# EAGLE design htsenti_mvp (EAGLE 9.6.2)
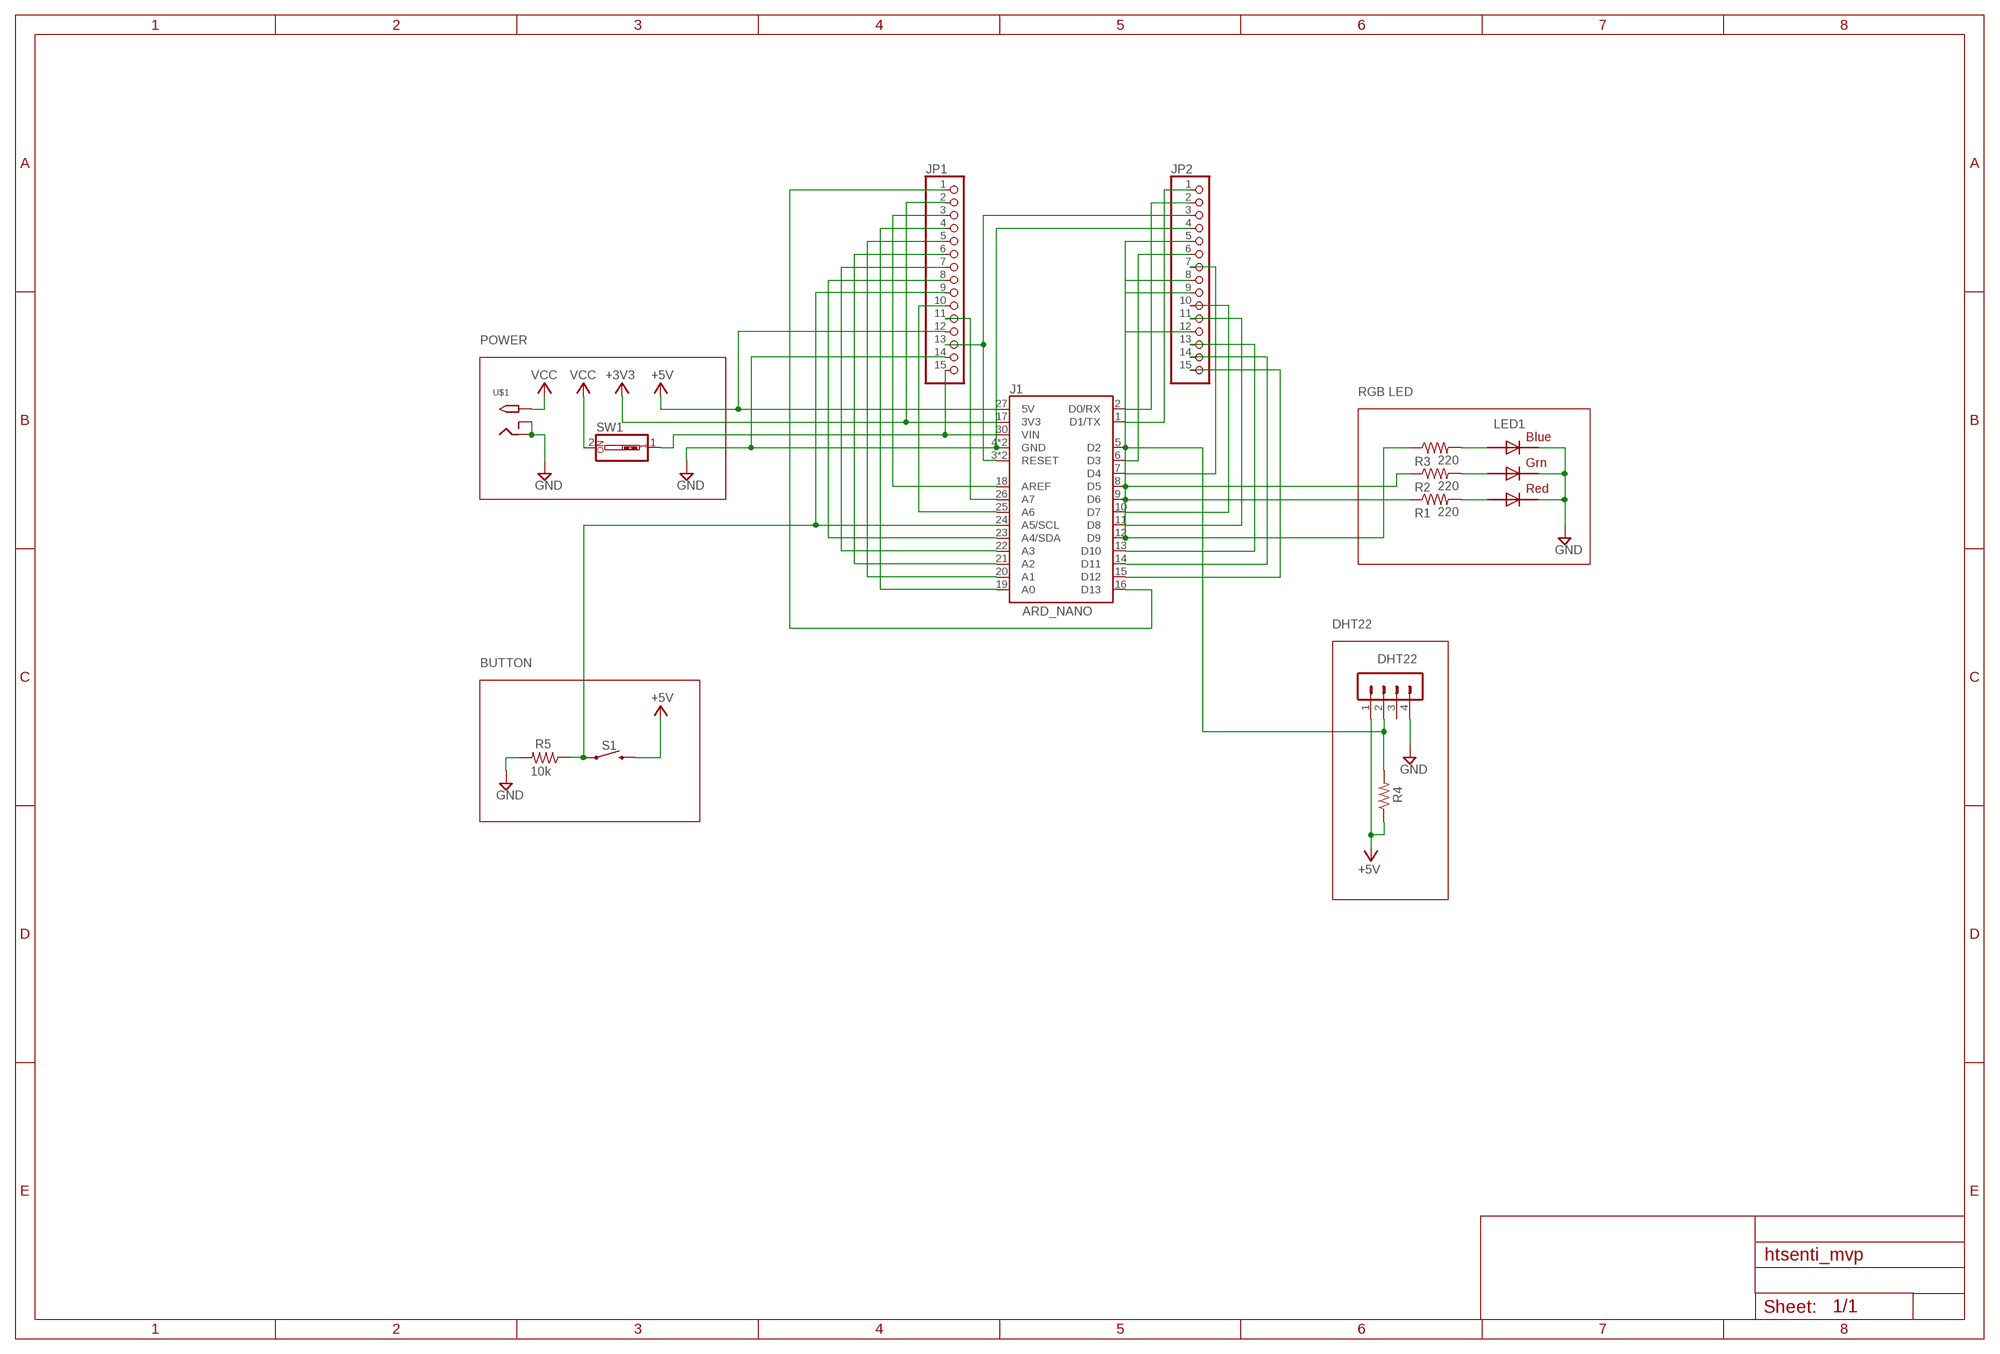
[diagram p0: schematic, sheet 1]

## Parts
DHT22  MA04-1  [MA04-1]
J1  NANO_FOOTPRINT  [NANO]
JP1  PINHD-1X15  [1X15]
JP2  PINHD-1X15  [1X15]
LED1  RGBLED5050  [RGBLED5050]
R1  220  220OHM-0603-1/10W-1%  [0603]
R2  220  220OHM-0603-1/10W-1%  [0603]
R3  220  220OHM-0603-1/10W-1%  [0603]
R4  R-US_M0805  [M0805]
R5  10k  R-US_M0805  [M0805]
S1  MOMENTARY-SWITCH-SPST-SMD-6.2MM-TALL  [TACTILE_SWITCH_SMD_6.2MM_TALL]
SW1  SW_DIP-1  [EDG-01]
U$1  2.1MMJACKSMT  [DCJACK_2MM_SMT]

## Nets
+3V3: J1.17(3V3) JP1.2
+5V: DHT22.1 J1.27(5V) JP1.12 R4.1 S1.B2
GND: DHT22.4 J1.4(GND) J1.29(GND) JP1.14 JP2.4 LED1.4(BLUE_C) LED1.5(RED_C) LED1.6(GREEN_C) R5.2 U$1.GND(RING) U$1.GNDBREAK(RING_SW)
N$1: LED1.2(RED_A) R1.2
N$2: LED1.1(GREEN_A) R2.2
N$3: LED1.3(BLUE_A) R3.2
N$4: J1.9(D6) JP2.9 R1.1
N$5: J1.8(D5) JP2.8 R2.1
N$6: J1.12(D9) JP2.12 R3.1
N$7: DHT22.2 J1.5(D2) JP2.5 R4.2
N$8: J1.24(A5/SCL) JP1.9 R5.1 S1.A2
N$9: J1.1(D1/TX) JP2.1
N$10: J1.30(VIN) JP1.15 SW1.1
N$11: J1.2(D0/RX) JP2.2
N$12: J1.3(RESET) J1.28(RESET) JP1.13 JP2.3
N$13: J1.6(D3) JP2.6
N$14: J1.7(D4) JP2.7
N$15: J1.10(D7) JP2.10
N$16: J1.11(D8) JP2.11
N$17: J1.13(D10) JP2.13
N$18: J1.14(D11) JP2.14
N$19: J1.15(D12) JP2.15
N$20: J1.16(D13) JP1.1
N$21: J1.18(AREF) JP1.3
N$22: J1.19(A0) JP1.4
N$23: J1.20(A1) JP1.5
N$24: J1.21(A2) JP1.6
N$25: J1.22(A3) JP1.7
N$26: J1.23(A4/SDA) JP1.8
N$28: J1.25(A6) JP1.10
N$29: J1.26(A7) JP1.11
VCC: SW1.2 U$1.PWR2(TIP)
Unconnected: DHT22.3

## Notes on the sheet
- POWER
- RGB LED
- ARD_NANO
- DHT22
- BUTTON

## Library data of the parts
DHT22 = con-lstb:MA04-1: PIN HEADER; OC_FARNELL: unknown; OC_NEWARK: unknown
J1 = SparkFun-Boards:NANO_FOOTPRINT: Generic Nano Footprint
JP1 JP2 = adafruit:PINHD-1X15: PIN HEADER
LED1 = adafruit:RGBLED: For 5050 RGB LEDs, the order of the LEDs may vary from one manufacturer to another!
R1-R3 = SparkFun-Resistors:220OHM: 220Ω resistor A resistor is a passive two-terminal electrical component that implements electrical resistance as a circuit element. Resistors act to reduce current flow, and, at the same time, act to lower voltage levels within circuits. - Wikipedia; PROD_ID: RES-07861
R4 R5 = adafruit:R-US_: RESISTOR, American symbol
S1 = SparkFun-Switches:MOMENTARY-SWITCH-SPST: Momentary Switch (Pushbutton) - SPST Normally-open (NO) SPST momentary switches (buttons, pushbuttons). Variants PTH-12MM - 12mm square, through-hole Momentary Pushbutton Switch - 12mm Square <https://www.sparkfun.com/products/9190> (COM-09190) PTH-6.0MM, PTH-6.0MM-KIT - 6.0mm square, through-hole Mini Pushbutton Switch <https://www.sparkfun.com/products/97> (COM-00097) KIT package intended for soldering kit's - only one side of pads' copper is exposed. PTH-RIGHT-ANGLE-KIT - Right-angle, through-hole Right Angle Tactile Button <https://www.sparkfun.com/products/10791> - Used on SparkFun BigTime Watch Kit <https://www.sparkfun.com/products/11734> SMD-12MM - 12mm square, surface-mount Tactile Button - SMD (12mm) <https://www.sparkfun.com/products/12993> (COM-12993) Used on SparkFun PicoBoard <https://www.sparkfun.com/products/11888> SMD-4.5MM - 4.5mm Square Trackball Switch Used on SparkFun Blackberry Trackballer Breakout <https://www.sparkfun.com/products/13169> SMD-4.6MMX2.8MM - 4.60mm x 2.80mm, surface mount Used on SparkFun SAMD21 Mini Breakout <https://www.sparkfun.com/products/13664> SMD-5.2MM, SMD-5.2-REDUNDANT - 5.2mm square, surface-mount Mini Pushbutton Switch - SMD <https://www.sparkfun.com/products/8720> (COM-08720) Used on Arduino Pro Mini <https://www.sparkfun.com/products/11114> REDUNDANT package connects both switch circuits together SMD-6.0X3.5MM - 6.0 x 3.5mm, surface mount Momentary Reset Switch SMD <https://www.sparkfun.com/products/8229> (COM-08229) SMD-6.2MM-TALL - 6.2mm square, surface mount Tactile Button - SMD (6mm) <https://www.sparkfun.com/products/12992> Used on SparkFun Digital Sandbox <https://www.sparkfun.com/products/12651> SMD-RIGHT-ANGLE - Right-angle, surface mount Used on SparkFun Block for Intel® Edison - Arduino <https://www.sparkfun.com/products/13036>; PROD_ID: SWCH-11966; SF_SKU: COM-12992
SW1 = special:SW_DIP-1: DIP SWITCH
U$1 = adafruit:2.1MMJACK: 2.1mm x 5.5mm THM DC jack with internal switch. Digikey part #PJ-102A, 4UCON part #05537 2.1mm x 5.5mm SMT DC jack with internal switch. Digikey part #PJ-002A-SMT, 4UCON part #03267 By microbuilder.eu & adafruit.com

## Board
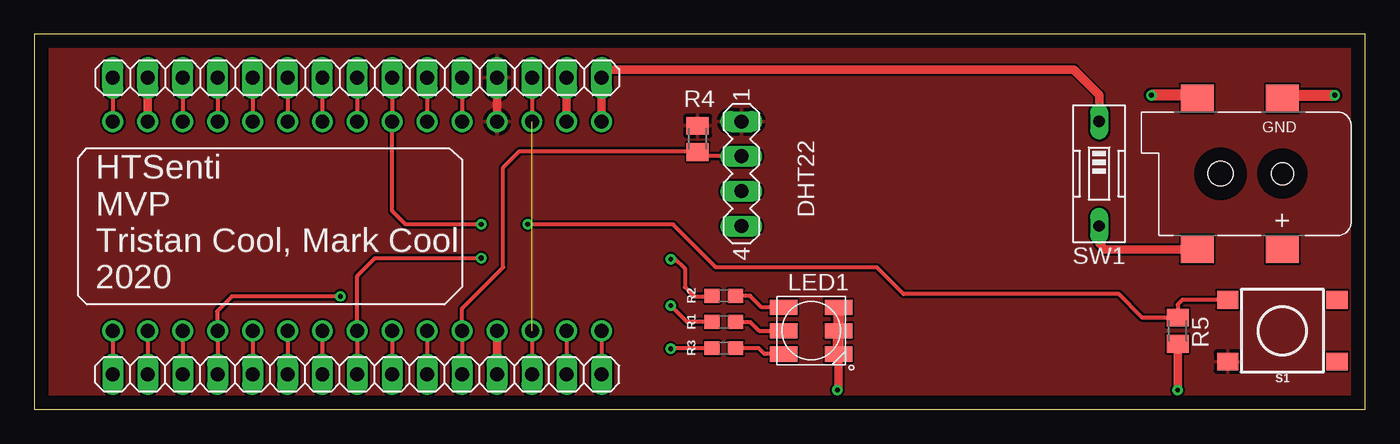
[diagram p1: board, top side]
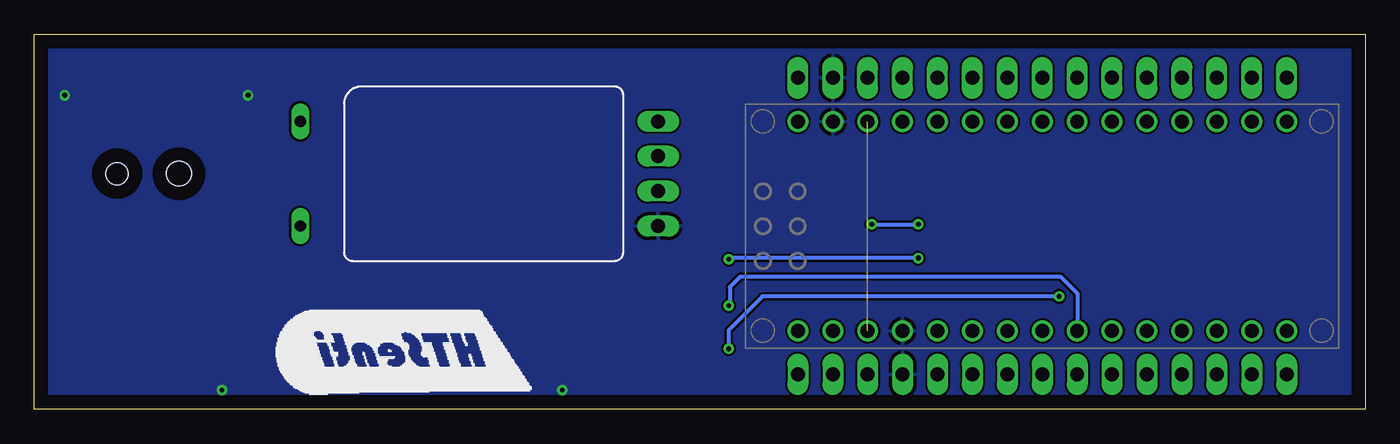
[diagram p2: board, bottom side, seen from below]

Size 96.83 x 27.3 mm. Coordinates in mm from the lower left corner, seen from the top.
Outline: 0,0 96.83,0 96.83,27.3 0,27.3 0,0
Copper layers (1*16): Top 0.035mm / dielectric 1.5mm / Bottom 0.035mm
Design rules "default": minimum track width 6mil, minimum drill 0.35mm, track to track 6mil, track to pad 6mil, pad to pad 6mil, via to via 6mil, smd to smd 6mil, copper to edge 40mil, drill to drill 6mil, minimum pad ring 10mil, minimum via ring 8mil, stop-mask expansion 4mil, vias tented up to drill 0mil, thermal gap 10mil

### Footprints (pad centres in the part's own frame; a part is rotated, then mirrored left to right if it is on the bottom)
MA04-1 = drill 1.016 long: 1 -3.81,0; 2 -1.27,0; 3 1.27,0; 4 3.81,0
NANO = drill 1.016: 1 -7.62,17.78; 2 -7.62,15.24; 3 -7.62,12.7; 4 -7.62,10.16; 5 -7.62,7.62; 6 -7.62,5.08; 7 -7.62,2.54; 8 -7.62,0; 9 -7.62,-2.54; 10 -7.62,-5.08; 11 -7.62,-7.62; 12 -7.62,-10.16; 13 -7.62,-12.7; 14 -7.62,-15.24; 15 -7.62,-17.78; 16 7.62,-17.78; 17 7.62,-15.24; 18 7.62,-12.7; 19 7.62,-10.16; 20 7.62,-7.62; 21 7.62,-5.08; 22 7.62,-2.54; 23 7.62,0; 24 7.62,2.54; 25 7.62,5.08; 26 7.62,7.62; 27 7.62,10.16; 28 7.62,12.7; 29 7.62,15.24; 30 7.62,17.78
1X15 = drill 1.016 long: 1 -17.78,0; 2 -15.24,0; 3 -12.7,0; 4 -10.16,0; 5 -7.62,0; 6 -5.08,0; 7 -2.54,0; 8 0,0; 9 2.54,0; 10 5.08,0; 11 7.62,0; 12 10.16,0; 13 12.7,0; 14 15.24,0; 15 17.78,0
RGBLED5050 = smd 2 x 1.1: 1 -2,1.7; 2 -2,0; 3 -2,-1.7; 4 2,-1.7; 5 2,0; 6 2,1.7
0603 = smd 1.1 x 1: 1 -0.85,0; 2 0.85,0
M0805 = smd 1.3 x 1.6: 1 -0.95,0; 2 0.95,0
TACTILE_SWITCH_SMD_6.2MM_TALL = smd 1.55 x 1.3: A1 -3.975,-2.25; A2 3.975,-2.25; B1 -3.975,2.25; B2 3.975,2.25
EDG-01 = drill 0.813 long: 1 0,-3.81; 2 0,3.81
DCJACK_2MM_SMT = smd 2.4 x 2: GND 0,-5.5; GNDBREAK 6.2,-5.5; PWR1 0,5.5; PWR2 6.2,5.5 | hole 1.6: 0,0 | hole 1.8: 4.5,0

### Placement (x,y rotation side)
DHT22  51.44,17.14 270 top
J1  23.5,13.34 90 bottom
JP1  23.5,24.13 0 top
JP2  23.5,2.54 180 top
LED1  56.52,5.71 0 top
R1  50.16,6.35 0 top
R2  50.16,8.26 0 top
R3  50.16,4.45 0 top
R4  48.26,19.68 270 top
R5  83.19,5.71 270 top
S1  90.81,5.71 180 top
SW1  77.47,17.14 180 top
U$1  90.81,17.14 180 top

### Tracks (layer width: path | path; a pad name or v marks a point on that pad's centre or on a via)
+3V3
  Top 0.61: J1.17 JP1.2
+5V
  Top 0.61: R4.1 48.58,20.95 | JP1.12 J1.27
  pour Top: 0,27.26 96.85,27.26 96.85,23.2 96.85,-0.08 96.76,-0.08 0,-0.08 0,1.1
GND  (via drill 0.35)
  Top 0.61: R5.2 v83.19,1.39 | LED1.4 58.52,1.49 v58.42,1.39 | JP2.4 J1.4 | JP1.14 J1.29
  Top 0.813: LED1.6 LED1.5 LED1.4 | U$1.GND 91.02,22.86 v94.61,22.86 | U$1.GNDBREAK 84.39,22.86 v81.28,22.86
  pour Bottom: 0.08,27.18 96.85,27.18 96.85,22.27 96.85,0.17 96.76,0.17 0.08,0.17 0.08,0.85
N$1
  Top 0.305: R1.2 52.07,6.35 52.7,5.71 LED1.2
N$2
  Top 0.305: LED1.1 52.91,7.42 52.07,8.26 R2.2
N$3
  Top 0.305: LED1.3 53.13,4.01 52.7,4.45 R3.2
N$4  (via drill 0.35)
  Top 0.305: R1.1 47.49,6.35 v46.31,7.54 | J1.9 JP2.9
  Bottom 0.305: v46.31,7.54 46.22,7.62 46.22,8.89 45.46,9.65 22.18,9.65 20.95,8.43 J1.9 | J1.9
N$5  (via drill 0.35)
  Top 0.305: JP2.8 J1.8 23.5,9.7 24.8,11.01 v32.51,11.01 | 49.23,8.34 R2.1 49.27,8.21 48,8.21 47.32,8.89 47.32,10.24 46.65,10.92 v46.31,10.92
  Bottom 0.305: v32.51,11.01 46.22,11.01 v46.31,10.92
N$6  (via drill 0.35)
  Top 0.305: J1.12 13.34,5.25 | 13.34,5.25 JP2.12 | v22.27,8.21 14.39,8.21 13.29,7.11 13.29,5.29 13.34,5.25 | R3.1 46.35,4.45 v46.31,4.4
  Bottom 0.305: v22.27,8.21 43.85,8.21 46.31,5.76 v46.31,4.4
N$7
  Top 0.305: DHT22.2 48.58,18.41 R4.2 48.2,18.79 35.3,18.79 34.12,17.61 34.12,10.33 31.11,7.33 J1.5 JP2.5
N$8  (via drill 0.35)
  Top 0.305: S1.A2 83.53,7.96 83.19,7.62 R5.1 80.62,6.67 78.9,8.38 63.24,8.38 61.29,10.33 49.61,10.33 46.48,13.46 v35.9,13.46 | JP1.9 J1.24 26.04,14.43 27.01,13.46 v32.51,13.46 | v35.9,13.46
  Bottom 0.305: v35.9,13.46 v32.51,13.46
N$9
  Top 0.305: J1.1 JP2.1
N$10
  Top 0.61: SW1.1 77.47,22.86 75.63,24.7 41.85,24.7 JP1.15 J1.30
N$11
  Top 0.305: J1.2 JP2.2
N$12  (1 unrouted)
  Top 0.305: J1.3 JP2.3 | JP1.13 J1.28
N$13
  Top 0.305: J1.6 JP2.6
N$14
  Top 0.305: J1.7 JP2.7
N$15
  Top 0.305: J1.10 JP2.10
N$16
  Top 0.305: J1.11 JP2.11
N$17
  Top 0.305: J1.13 JP2.13
N$18
  Top 0.305: J1.14 JP2.14
N$19
  Top 0.305: J1.15 JP2.15
N$20
  Top 0.305: JP1.1 J1.16
N$21
  Top 0.305: JP1.3 J1.18
N$22
  Top 0.305: JP1.4 J1.19
N$23
  Top 0.305: JP1.5 J1.20
N$24
  Top 0.305: JP1.6 J1.21
N$25
  Top 0.305: JP1.7 J1.22
N$26
  Top 0.305: JP1.8 J1.23
N$28
  Top 0.305: JP1.10 J1.25
N$29
  Top 0.305: JP1.11 J1.26
VCC
  Top 0.61: U$1.PWR2 77.89,11.64 77.47,12.06 SW1.2

### Text on the board
tNames: HTSenti / MVP / Tristan Cool, Mark Cool / 2020